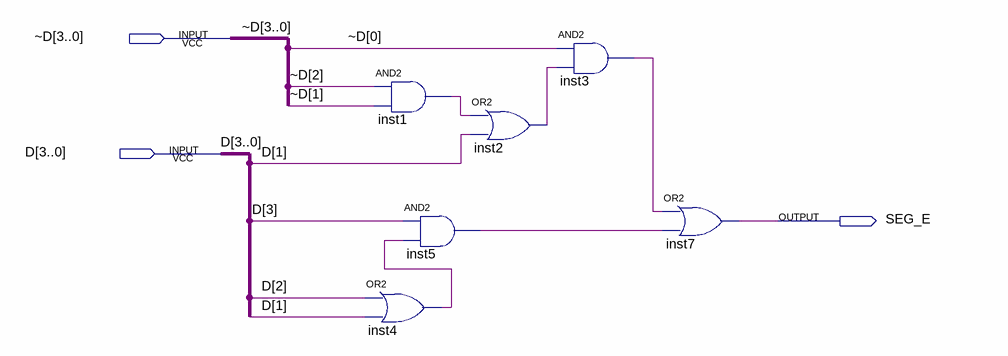
[diagram p0: schematic sheet]
// Quartus schematic SEG_E.bdf as structural Verilog: 6 symbols, 3 pins
module SEG_E (
  input  [3:0] \~D ,
  input  [3:0] D,
  output SEG_E
);

  wire inst1_out, inst2_out, inst3_out, inst4_out, inst5_out;

  and inst1 (inst1_out, \~D [2], \~D [1]);
  and inst5 (inst5_out, D[3], inst4_out);
  or inst4 (inst4_out, D[2], D[1]);
  or inst2 (inst2_out, inst1_out, D[1]);
  and inst3 (inst3_out, \~D [0], inst2_out);
  or inst7 (SEG_E, inst3_out, inst5_out);
endmodule
